# Altium project PCB_Project.PrjPcb
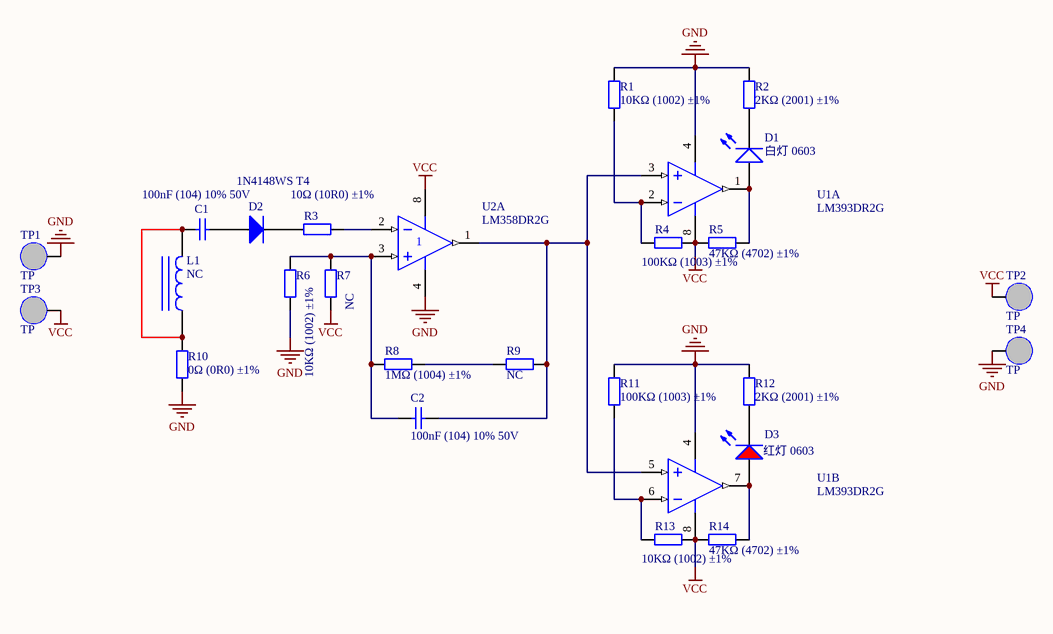
[diagram p0: electromagnetic.SchDoc]
1 sheet, 26 parts. Net scope: global (net labels, ports and power ports of the same name join across sheets).
Board file: electromagnetic.PcbDoc

## Sheet electromagnetic.SchDoc
size A4

### Parts
C1  100nF (104) 10% 50V  [0603_C]
C2  100nF (104) 10% 50V  [0603_C]
D1  白灯 0603  [0603_LED_S1]
D2  1N4148WS T4  [SOD-323]
D3  红灯 0603  [0603_LED_S1]
L1  NC  [0603_L]
R1  10KΩ (1002) ±1%  [0603_R]
R2  2KΩ (2001) ±1%  [0603_R]
R3  10Ω (10R0) ±1%  [0603_R]
R4  100KΩ (1003) ±1%  [0603_R]
R5  47KΩ (4702) ±1%  [0603_R]
R6  10KΩ (1002) ±1%  [0603_R]
R7  NC  [0603_R]
R8  1MΩ (1004) ±1%  [0603_R]
R9  NC  [0603_R]
R10  0Ω (0R0) ±1%  [0603_R]
R11  100KΩ (1003) ±1%  [0603_R]
R12  2KΩ (2001) ±1%  [0603_R]
R13  10KΩ (1002) ±1%  [0603_R]
R14  47KΩ (4702) ±1%  [0603_R]
TP1  TP  [TP]
TP2  TP  [TP]
TP3  TP  [TP]
TP4  TP  [TP]
U1  LM393DR2G  [SOIC-8_150mil]  (parts A,B of 2)
U2  LM358DR2G  [SOIC-8_150mil]  (part A of 2)

### Nets
GND: R1.2 R2.2 R6.1 R10.1 R11.2 R12.2 TP1.1 TP4.1 U1.4(GND) U2.4(V-)
VCC: R4.2 R5.1 R7.1 R13.1 R14.1 TP2.1 TP3.1 U1.8(V+) U2.8(V+)
NetC1_1: C1.1 L1.1 L1.2 R10.2
NetC1_2: C1.2 D2.1(A)
NetC2_1: C2.1 R6.2 R7.2 R8.1 U2.3(IN+)
NetC2_2: C2.2 R9.2 U1.3(IN+) U1.5(IN+) U2.1(OUT)
NetD1_A: D1.A R5.2 U1.1(OUT)
NetD1_K: D1.K R2.1
NetD2_2: D2.2(K) R3.1
NetD3_A: D3.A R14.2 U1.7(OUT)
NetD3_K: D3.K R12.1
NetR1_1: R1.1 R4.1 U1.2(IN-)
NetR3_2: R3.2 U2.2(IN-)
NetR8_2: R8.2 R9.1
NetR11_1: R11.1 R13.2 U1.6(IN-)

### Library data of the parts
C1 C2 = 0603 100nF (104) 10% 50V: 贴片电容; ComponentLink1Description: 供应商链接; ComponentLink1URL: http://www.szlcsc.com/product/details_15331.html; Package: 0603; Supplier: LC; SuppliersPartNumber: C14663
D1 = 0603 白灯: 发光二极管; ComponentLink1Description: 供应商链接; ComponentLink1URL: http://www.szlcsc.com/product/details_2663.html; Package: 0603; Supplier: LC; SuppliersPartNumber: C2290
D2 = SOD-323 1N4148WS T4: 二极管; ComponentLink1Description: 供应商链接; ComponentLink1URL: http://www.szlcsc.com/product/details_2485.html; Package: SOD-323; Supplier: LC; SuppliersPartNumber: C2128
D3 = 0603 红灯: 发光二极管; ComponentLink1Description: 供应商链接; ComponentLink1URL: http://www.szlcsc.com/product/details_2659.html; Package: 0603; Supplier: LC; SuppliersPartNumber: C2286
L1 = 0603 47nH: 贴片电感; ComponentLink1Description: 供应商链接; ComponentLink1URL: http://www.szlcsc.com/product/details_30437.html; Package: 0603; Supplier: LC; SuppliersPartNumber: C29683
R1 R6 R13 = 0603 10KΩ (1002) 1%: 贴片电阻; ComponentLink1Description: 供应商链接; ComponentLink1URL: http://www.szlcsc.com/product/details_26547.html; Package: 0603; Supplier: LC; SuppliersPartNumber: C25804
R2 R12 = 0603 2KΩ (2001) 1%: 贴片电阻; ComponentLink1Description: 供应商链接; ComponentLink1URL: http://www.szlcsc.com/product/details_23702.html; Package: 0603; Supplier: LC; SuppliersPartNumber: C22975
R3 = 0603 10Ω (10R0) 1%: 贴片电阻; ComponentLink1Description: 供应商链接; ComponentLink1URL: http://www.szlcsc.com/product/details_23586.html; Package: 0603; Supplier: LC; SuppliersPartNumber: C22859
R4 R11 = 0603 100KΩ (1003) 1%: 贴片电阻; ComponentLink1Description: 供应商链接; ComponentLink1URL: http://www.szlcsc.com/product/details_26546.html; Package: 0603; Supplier: LC; SuppliersPartNumber: C25803
R5 R14 = 0603 47KΩ (4702) 1%: 贴片电阻; ComponentLink1Description: 供应商链接; ComponentLink1URL: http://www.szlcsc.com/product/details_26562.html; Package: 0603; Supplier: LC; SuppliersPartNumber: C25819
R7 = 0603 1KΩ (1001) 1%: 贴片电阻; ComponentLink1Description: 供应商链接; ComponentLink1URL: http://www.szlcsc.com/product/details_21904.html; Package: 0603; Supplier: LC; SuppliersPartNumber: C21190
R8 R9 = 0603 1MΩ (1004) 1%: 贴片电阻; ComponentLink1Description: 供应商链接; ComponentLink1URL: http://www.szlcsc.com/product/details_23662.html; Package: 0603; Supplier: LC; SuppliersPartNumber: C22935
R10 = 0603 0Ω (0R0) 1%: 贴片电阻; ComponentLink1Description: 供应商链接; ComponentLink1URL: http://www.szlcsc.com/product/details_21903.html; Package: 0603; Supplier: LC; SuppliersPartNumber: C21189
U1 = LM393DR2G_[C7955]: 电压比较器; ComponentLink1Description: 供应商链接; ComponentLink1URL: http://www.szlcsc.com/product/details_8432.html; Package: SOIC-8; Supplier: LC; SuppliersPartNumber: C7955
U2 = LM358DR2G_[C7950]: 通用运放; ComponentLink1Description: 供应商链接; ComponentLink1URL: http://www.szlcsc.com/product/details_8427.html; Package: SOIC-8; Supplier: LC; SuppliersPartNumber: C7950